# Altium schematic sheet 07. USB OTG.SchDoc
size A4; CheckedBy: 黄钦宁; Author: 陈坤; DocumentNumber: 7; SheetNumber: 7; SheetTotal: 13; PageSetup: Record=PageOptions|CenterHorizontal=True|CenterVertical=True|PrintScale=1.00|XCorrection=1.00|YCorrection=1.00|PrintKind=0|BorderSize=5000000|LeftOffset=0|BottomOffset=0|Orientation=2|PaperLength=1000|PaperWidth=1000|Scale=100|PaperSource=7|PrintQuality=600|MediaType=1|DitherType=10|PaperKind=A4|PrintScaleMode=1; DesignDate: 2013-08-16; CheckDate: 2013-12-28; SheetName: USB_OTG; SheetVersion: V1.00; SheetDescription: USB_OTG接口; ProductName: EasyARM-iMX28学习套件; ProductModel: EasyARM-iMX283
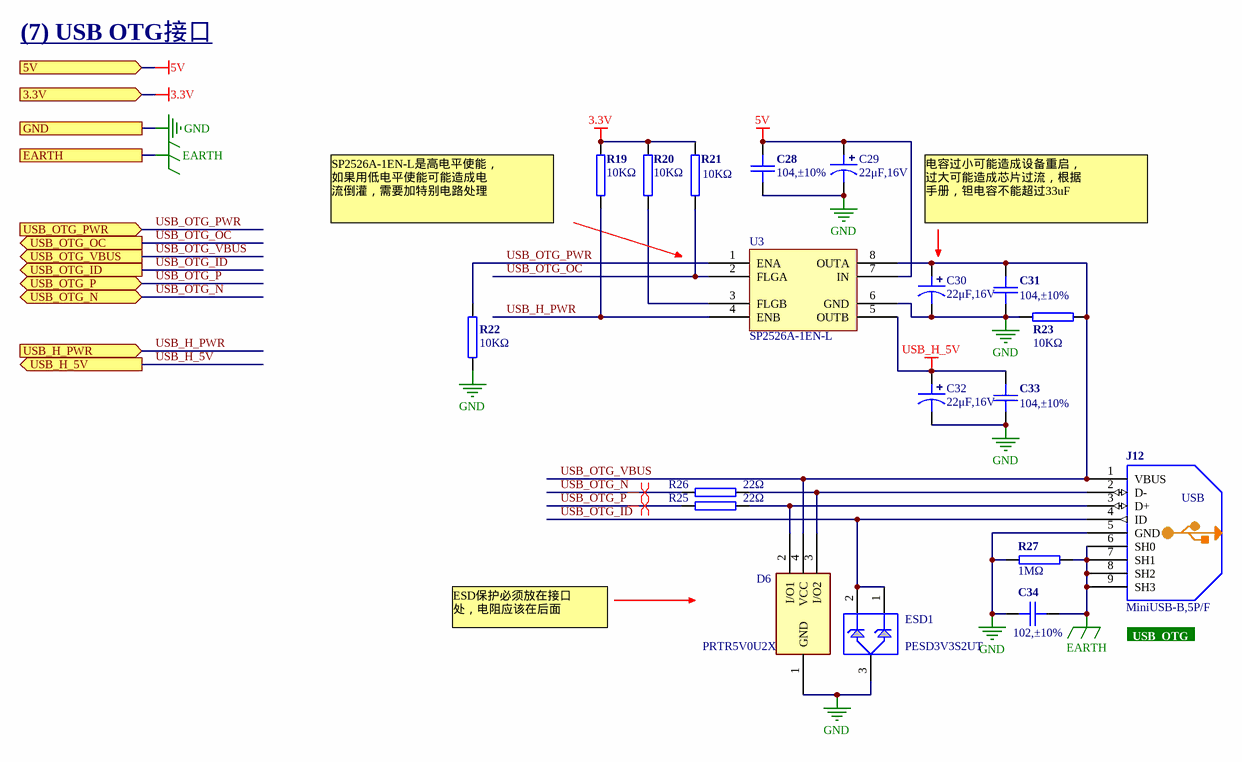
[diagram p0: 07. USB OTG.SchDoc]

## Parts
C28  104,±10%  [0603C]
C29  22μF,16V  [CAP-B]
C30  22μF,16V  [CAP-B]
C31  104,±10%  [0603C]
C32  22μF,16V  [CAP-B]
C33  104,±10%  [0603C]
C34  102,±10%  [1206C]
D6  PRTR5V0U2X  [SOT-143]
ESD1  value PESD3V3S2UT  [SOT-23]  (hidden comment: ESD-3)
J12  value MiniUSB-B,5P/F  [USB_MINIB_SMT]  (hidden comment: USB_MINIB_SMT)
R19  10KΩ  [0603R]
R20  10KΩ  [0603R]
R21  10KΩ  [0603R]
R22  10KΩ  [0603R]
R23  10KΩ  [0603R]
R25  22Ω  [0603R]
R26  22Ω  [0603R]
R27  1MΩ  [1206R]
U3  value SP2526A-1EN-L  [SOIC127P600X175-8N]  (hidden comment: SP2526A)

## Ports
3.3V (in), 5V, EARTH, GND, USB_H_5V (out), USB_H_PWR (in), USB_OTG_ID (out), USB_OTG_N (bidir), USB_OTG_OC (out), USB_OTG_P (bidir), USB_OTG_PWR (in), USB_OTG_VBUS (out)

## Nets
3.3V: R19.2 R20.2 R21.2 ; port 3.3V
5V: C28.1 C29.1 U3.7(IN) ; port 5V
EARTH: C34.2 J12.6(SH0) J12.7(SH1) J12.8(SH2) J12.9(SH3) R27.2 ; port EARTH
GND: C28.2 C29.2 C30.2 C31.1 C32.2 C33.1 C34.1 D6.1(GND) ESD1.3 J12.5(GND) R22.1 R23.2 R27.1 U3.6(GND) ; port GND
USB_H_5V: C32.1 C33.2 U3.5(OUTB) ; port USB_H_5V
USB_H_PWR: R19.1 U3.4(ENB) ; port USB_H_PWR
USB_OTG_ID: ESD1.1 ESD1.2 J12.4(ID) ; port USB_OTG_ID
USB_OTG_N: R26.2 ; port USB_OTG_N
USB_OTG_OC: R21.1 U3.2(FLGA) ; port USB_OTG_OC
USB_OTG_P: R25.2 ; port USB_OTG_P
USB_OTG_PWR: R22.2 U3.1(ENA) ; port USB_OTG_PWR
USB_OTG_VBUS: C30.1 C31.2 D6.4(VCC) J12.1(VBUS) R23.1 U3.8(OUTA) ; port USB_OTG_VBUS
NetD6_2: D6.2(I/O1) J12.3(D+) R25.1
NetD6_3: D6.3(I/O2) J12.2(D-) R26.1
NetR20_1: R20.1 U3.3(FLGB)

## Layout directives
differential pair: USB_OTG_N, USB_OTG_P

## Notes on the sheet
- (7) USB OTG接口
- (near R19) SP2526A-1EN-L是高电平使能，
  如果用低电平使能可能造成电
  流倒灌，需要加特别电路处理
- 电容过小可能造成设备重启，
  过大可能造成芯片过流，根据
  手册，钽电容不能超过33uF
- ESD保护必须放在接口
  处，电阻应该在后面
- (near J12) USB_OTG
- 1
- #
- 修改日期
- 修改内容
- 2
- 3
- 广州致远电子股份有限公司
- 设计人员
- 审核人员
- 设计日期
- 审核日期
- 产品名称
- 图纸名称
- 产品型号
- 图纸描述
- 图纸版本
- A4
- (in symbol 1.10.05.0024) USB

## Library data of the parts
C28 = 1.02.01.0032: Capacitor; 名称: 电容; 规格型号: 104,±10%,50V,X7R,0603,*,RoHS; 贴片和直插: SMT; 现有库存: 1717054; 封装: 0603; 设备封装名称: C0603_104_X7R_50V_10%; 物料代码: 1.02.01.0032; Value: 104,±10%; RoHS: RoHS; ComponentLink1Description: ErpDataInfo; ComponentLink1URL: http://erp.zlgmcu.com/ErpExt/ErpData/ListMateriel.aspx?pkey=1.02.01.0032
C29 C30 C32 = 1.02.05.0015: 22μF,16V,B型,,AVX,RoHS; 名称: 钽电容; 设备封装名称: B_22uF_16V; 贴片和直插: SMT; 器件优选方案: 优先选用; 物料代码: 1.02.05.0015; Value: 22μF,16V; 厂商: AVX; RoHS: RoHS; 型号: 22μF,16V,B型; ComponentLink1Description: ErpDataInfo; ComponentLink1URL: http://erp.zlgmcu.com/ErpExt/ErpData/ListMateriel.aspx?pkey=1.02.05.0015
C31 C33 = 1.02.01.0032: Capacitor; 名称: 电容; 规格型号: 104,±10%,50V,X7R,0603,*,RoHS; 封装: 0603; 设备封装名称: C0603_104_X7R_50V_10%; 贴片和直插: SMT; 现有库存: 1717054; 物料代码: 1.02.01.0032; Value: 104,±10%; RoHS: RoHS; ComponentLink1Description: ErpDataInfo; ComponentLink1URL: http://erp.zlgmcu.com/ErpExt/ErpData/ListMateriel.aspx?pkey=1.02.01.0032
C34 = 1.02.03.0003: Capacitor; 名称: 电容; 规格型号: 102,±10%,2KV,X7R,1206,*,RoHS; 封装: 1206; 设备封装名称: C1206_102_X7R_2KV_10%; 贴片和直插: SMT; 现有库存: 26517; 物料代码: 1.02.03.0003; Value: 102,±10%; RoHS: RoHS; ComponentLink1Description: ErpDataInfo; ComponentLink1URL: http://erp.zlgmcu.com/ErpExt/ErpData/ListMateriel.aspx?pkey=1.02.03.0003
D6 = 1.05.10.0153: PRTR5V0U2X,SOT-143B,NXP,RoHS; 名称: IC; 设备封装名称: SOT-143B_PRTR5V0U2X; 贴片和直插: SMT; 物料代码: 1.05.10.0153; Value: PRTR5V0U2X; 封装: SOT-143B; 厂商: NXP; RoHS: RoHS; 型号: PRTR5V0U2X; ComponentLink1Description: ErpDataInfo; ComponentLink1URL: http://erp.zlgmcu.com/ErpExt/ErpData/ListMateriel.aspx?pkey=1.05.10.0153
ESD1 = 1.05.10.0361: PESD3V3S2UT,SOT-23,NXP,RoHS; 名称: IC; 设备封装名称: SOT-23_PESD3V3S2UT; 贴片和直插: SMT; 物料代码: 1.05.10.0361; 封装: SOT-23; 厂商: NXP; RoHS: RoHS; 型号: PESD3V3S2UT; ComponentLink1Description: ErpDataInfo; ComponentLink1URL: http://erp.zlgmcu.com/ErpExt/ErpData/ListMateriel.aspx?pkey=1.05.10.0361
J12 = 1.10.05.0024: MiniUSB-B,5P/F,7.6×9×4,SMD,RoHS; Text Field1: 100; Text Field2: 80; 名称: USB插座; 贴片和直插: SMT; 物料代码: 1.10.05.0024; RoHS: RoHS; 型号: MiniUSB-B,5P/F,7.6×9×4,SMD; ComponentLink1Description: ErpDataInfo; ComponentLink1URL: http://erp.zlgmcu.com/ErpExt/ErpData/ListMateriel.aspx?pkey=1.10.05.0024
R19-R22 = 1.01.01.0051: 名称: 电阻; 规格型号: 10KΩ,0603,*,RoHS; 封装: 0603; 设备封装名称: R0603_10K; 贴片和直插: SMT; 现有库存: 693985; 物料代码: 1.01.01.0051; Value: 10KΩ; RoHS: RoHS; ComponentLink1Description: ErpDataInfo; ComponentLink1URL: http://erp.zlgmcu.com/ErpExt/ErpData/ListMateriel.aspx?pkey=1.01.01.0051
R23 = 1.01.01.0051: 10KΩ,0603,*,RoHS; 名称: 电阻; 封装: 0603; 设备封装名称: R0603_10K; 贴片和直插: SMT; 物料代码: 1.01.01.0051; Value: 10KΩ; RoHS: RoHS; 型号: 10KΩ; ComponentLink1Description: ErpDataInfo; ComponentLink1URL: http://erp.zlgmcu.com/ErpExt/ErpData/ListMateriel.aspx?pkey=1.01.01.0051
R25 R26 = 1.01.01.0014: 名称: 电阻; 规格型号: 22Ω,0603,*,RoHS; 现有库存: 99098; 物料代码: 1.01.01.0014; Value: 22Ω; ComponentLink1Description: ErpDataInfo; ComponentLink1URL: http://192.168.0.2:8012/ErpExt/ErpData/ListMateriel.aspx?pkey=1.01.01.0014
R27 = 1.01.03.0019: 名称: 电阻; 规格型号: 1MΩ,1206,RoHS; 封装: 1206; 设备封装名称: R1206_1M; 贴片和直插: SMT; 现有库存: 12252; 物料代码: 1.01.03.0019; Value: 1MΩ; RoHS: RoHS; ComponentLink1Description: ErpDataInfo; ComponentLink1URL: http://erp.zlgmcu.com/ErpExt/ErpData/ListMateriel.aspx?pkey=1.01.03.0019
U3 = 1.05.09.0064: SP2526A-1EN-L,SO-8,EXAR,RoHS; 名称: IC; 设备封装名称: SO-8_SP2526A-1EN-L; 贴片和直插: SMT; 物料代码: 1.05.09.0064; 封装: SO-8; 厂商: EXAR; RoHS: RoHS; 型号: SP2526A-1EN-L; ComponentLink1Description: ErpDataInfo; ComponentLink1URL: http://erp.zlgmcu.com/ErpExt/ErpData/ListMateriel.aspx?pkey=1.05.09.0064